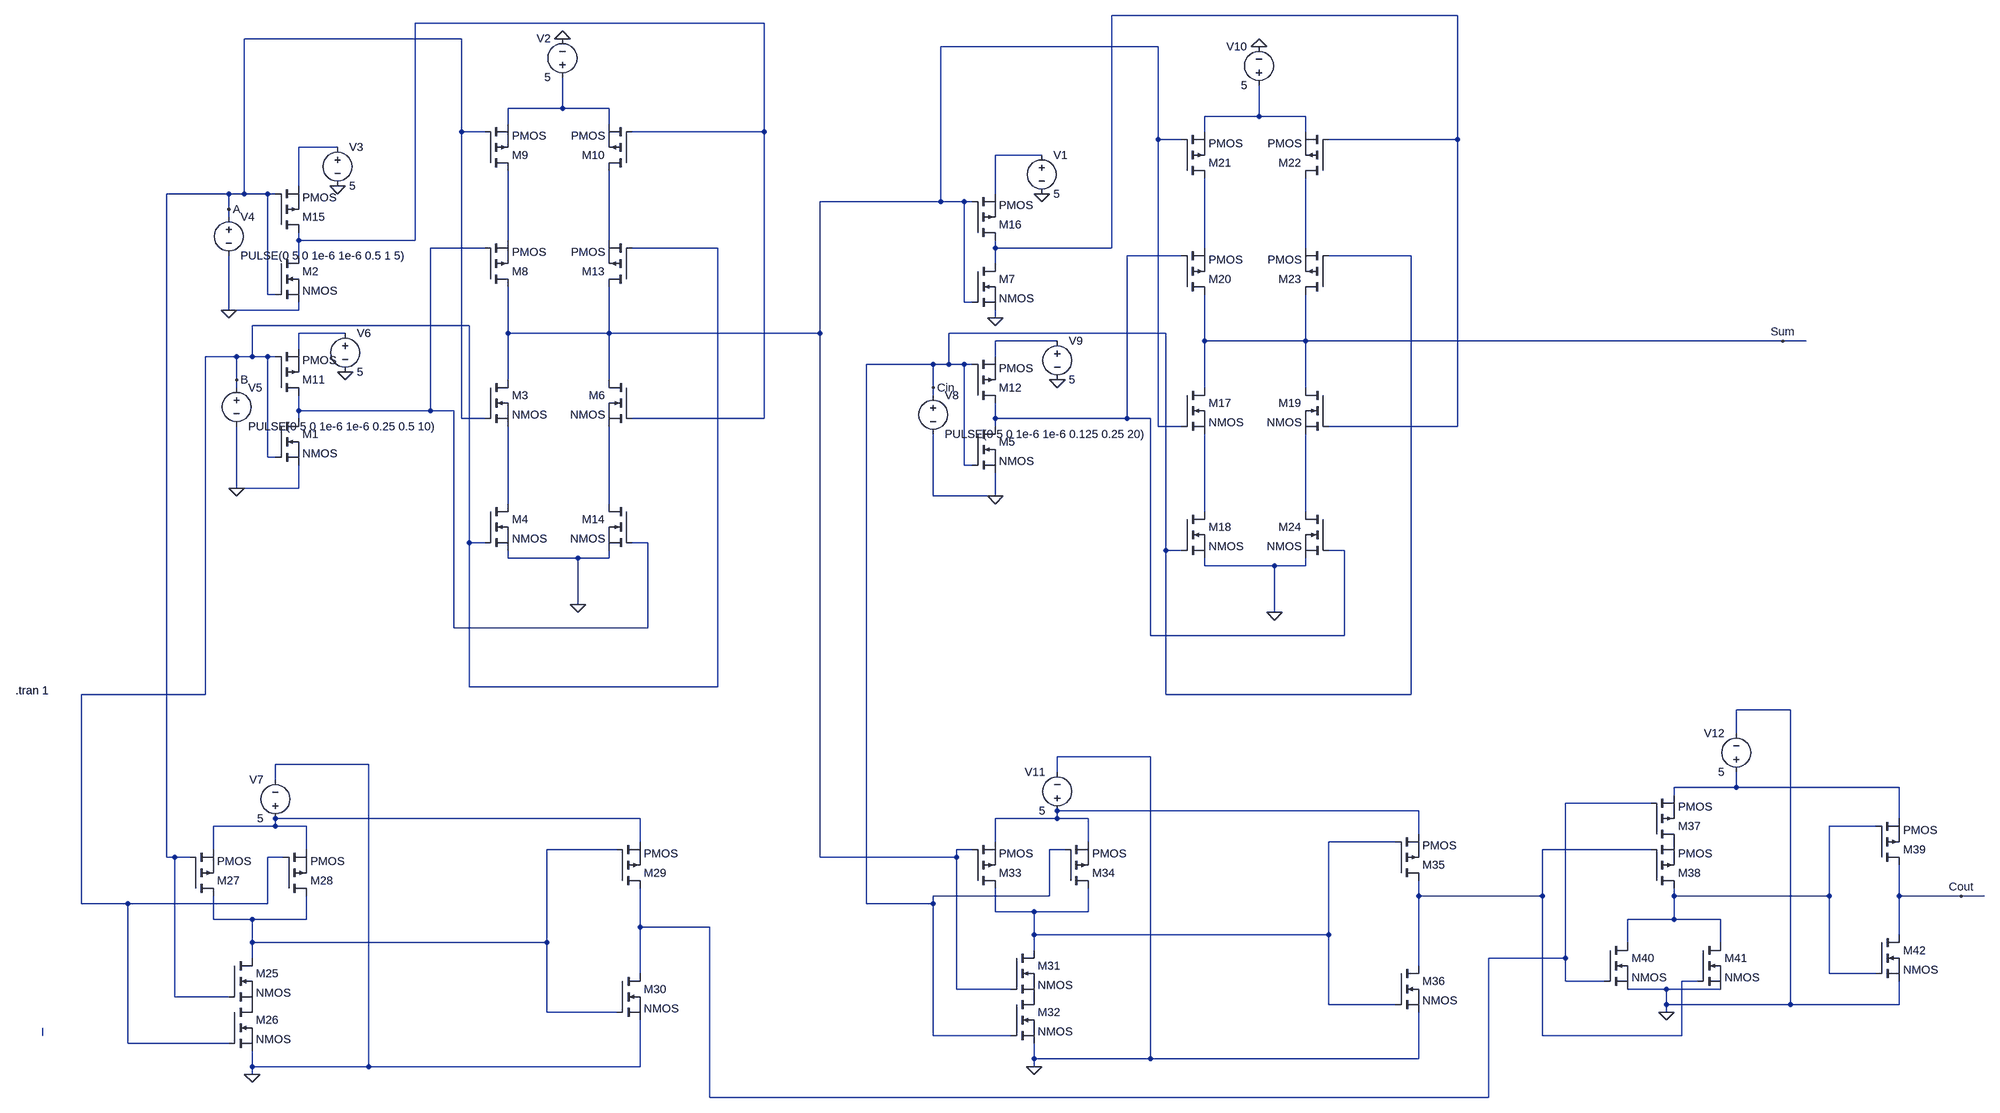
[diagram p0: schematic cmos 1 bit full adder 238.asc]
cmos 1 bit full adder 238.asc, the LTspice schematic file:
Version 4
SHEET 1 6156 4088
WIRE 3136 512 2416 512
WIRE 1216 528 496 528
WIRE 592 560 144 560
WIRE 2512 576 2064 576
WIRE 800 704 800 640
WIRE 800 704 688 704
WIRE 896 704 800 704
WIRE 2720 720 2720 656
WIRE 2720 720 2608 720
WIRE 2816 720 2720 720
WIRE 688 736 688 704
WIRE 896 736 896 704
WIRE 592 752 592 560
WIRE 640 752 592 752
WIRE 1216 752 1216 528
WIRE 1216 752 944 752
WIRE 2608 752 2608 720
WIRE 2816 752 2816 720
WIRE 2512 768 2512 576
WIRE 2560 768 2512 768
WIRE 3136 768 3136 512
WIRE 3136 768 2864 768
WIRE 336 784 256 784
WIRE 2272 800 2176 800
WIRE 256 864 256 784
WIRE 112 880 -16 880
WIRE 144 880 144 560
WIRE 144 880 112 880
WIRE 192 880 144 880
WIRE 208 880 192 880
WIRE 2176 880 2176 800
WIRE 2064 896 2064 576
WIRE 2064 896 1808 896
WIRE 2112 896 2064 896
WIRE 2128 896 2112 896
WIRE 112 912 112 880
WIRE 112 928 112 912
WIRE 256 976 256 960
WIRE 496 976 496 528
WIRE 496 976 256 976
WIRE 688 976 688 832
WIRE 896 976 896 832
WIRE 640 992 528 992
WIRE 1120 992 944 992
WIRE 2176 992 2176 976
WIRE 2416 992 2416 512
WIRE 2416 992 2176 992
WIRE 2608 992 2608 848
WIRE 2816 992 2816 848
WIRE 256 1008 256 976
WIRE 2560 1008 2448 1008
WIRE 3040 1008 2864 1008
WIRE 2176 1024 2176 992
WIRE 192 1088 192 880
WIRE 208 1088 192 1088
WIRE 2112 1104 2112 896
WIRE 2128 1104 2112 1104
WIRE 112 1120 112 1008
WIRE 256 1120 256 1104
WIRE 256 1120 112 1120
WIRE 2176 1136 2176 1120
WIRE 608 1152 160 1152
WIRE 352 1168 256 1168
WIRE 688 1168 688 1072
WIRE 896 1168 896 1072
WIRE 896 1168 688 1168
WIRE 1808 1168 1808 896
WIRE 1808 1168 896 1168
WIRE 2528 1168 2080 1168
WIRE 2304 1184 2176 1184
WIRE 2608 1184 2608 1088
WIRE 2816 1184 2816 1088
WIRE 2816 1184 2608 1184
WIRE 3872 1184 2816 1184
WIRE 3920 1184 3872 1184
WIRE 256 1200 256 1168
WIRE 128 1216 64 1216
WIRE 160 1216 160 1152
WIRE 160 1216 128 1216
WIRE 192 1216 160 1216
WIRE 208 1216 192 1216
WIRE 2176 1216 2176 1184
WIRE 2048 1232 1904 1232
WIRE 2080 1232 2080 1168
WIRE 2080 1232 2048 1232
WIRE 2112 1232 2080 1232
WIRE 2128 1232 2112 1232
WIRE 128 1264 128 1216
WIRE 688 1264 688 1168
WIRE 896 1264 896 1168
WIRE 128 1280 128 1264
WIRE 2048 1280 2048 1232
WIRE 2608 1280 2608 1184
WIRE 2816 1280 2816 1184
WIRE 2048 1296 2048 1280
WIRE 256 1328 256 1296
WIRE 528 1328 528 992
WIRE 528 1328 256 1328
WIRE 576 1328 528 1328
WIRE 256 1344 256 1328
WIRE 592 1344 592 752
WIRE 640 1344 592 1344
WIRE 1216 1344 1216 752
WIRE 1216 1344 944 1344
WIRE 2176 1344 2176 1312
WIRE 2448 1344 2448 1008
WIRE 2448 1344 2176 1344
WIRE 2496 1344 2448 1344
WIRE 2176 1360 2176 1344
WIRE 2512 1360 2512 768
WIRE 2560 1360 2512 1360
WIRE 3136 1360 3136 768
WIRE 3136 1360 2864 1360
WIRE 192 1424 192 1216
WIRE 208 1424 192 1424
WIRE 2112 1440 2112 1232
WIRE 2128 1440 2112 1440
WIRE 128 1488 128 1360
WIRE 256 1488 256 1440
WIRE 256 1488 128 1488
WIRE 2048 1504 2048 1376
WIRE 2176 1504 2176 1456
WIRE 2176 1504 2048 1504
WIRE 688 1520 688 1360
WIRE 896 1520 896 1360
WIRE 2608 1536 2608 1376
WIRE 2816 1536 2816 1376
WIRE 608 1600 608 1152
WIRE 640 1600 608 1600
WIRE 976 1600 944 1600
WIRE 2528 1616 2528 1168
WIRE 2560 1616 2528 1616
WIRE 2896 1616 2864 1616
WIRE 688 1632 688 1616
WIRE 832 1632 688 1632
WIRE 896 1632 896 1616
WIRE 896 1632 832 1632
WIRE 2608 1648 2608 1632
WIRE 2752 1648 2608 1648
WIRE 2816 1648 2816 1632
WIRE 2816 1648 2752 1648
WIRE 832 1728 832 1632
WIRE 2752 1744 2752 1648
WIRE 576 1776 576 1328
WIRE 976 1776 976 1600
WIRE 976 1776 576 1776
WIRE 2496 1792 2496 1344
WIRE 2896 1792 2896 1616
WIRE 2896 1792 2496 1792
WIRE 608 1936 608 1600
WIRE 1120 1936 1120 992
WIRE 1120 1936 608 1936
WIRE 64 1952 64 1216
WIRE 64 1952 -192 1952
WIRE 2528 1952 2528 1616
WIRE 3040 1952 3040 1008
WIRE 3040 1952 2528 1952
WIRE 3888 1984 3776 1984
WIRE 3776 2032 3776 1984
WIRE 2496 2080 2304 2080
WIRE 400 2096 208 2096
WIRE 2304 2112 2304 2080
WIRE 208 2128 208 2096
WIRE 3776 2144 3776 2112
WIRE 3776 2144 3648 2144
WIRE 4112 2144 3776 2144
WIRE 3648 2160 3648 2144
WIRE 3600 2176 3424 2176
WIRE 3056 2192 2304 2192
WIRE 960 2208 208 2208
WIRE 2304 2208 2304 2192
WIRE 2304 2208 2176 2208
WIRE 2368 2208 2304 2208
WIRE 4112 2208 4112 2144
WIRE 208 2224 208 2208
WIRE 208 2224 80 2224
WIRE 272 2224 208 2224
WIRE 4064 2224 3968 2224
WIRE 3056 2240 3056 2192
WIRE 960 2256 960 2208
WIRE 2176 2256 2176 2208
WIRE 2368 2256 2368 2208
WIRE 3008 2256 2864 2256
WIRE 80 2272 80 2224
WIRE 272 2272 272 2224
WIRE 912 2272 768 2272
WIRE 2128 2272 2096 2272
WIRE 2320 2272 2288 2272
WIRE 3600 2272 3376 2272
WIRE -16 2288 -16 880
WIRE 0 2288 -16 2288
WIRE 32 2288 0 2288
WIRE 224 2288 192 2288
WIRE 1808 2288 1808 1168
WIRE 2096 2288 2096 2272
WIRE 2096 2288 1808 2288
WIRE 2288 2368 2288 2272
WIRE 2288 2368 2048 2368
WIRE 3056 2368 3056 2336
WIRE 3376 2368 3376 2272
WIRE 3376 2368 3056 2368
WIRE 3648 2368 3648 2352
WIRE 3968 2368 3968 2224
WIRE 3968 2368 3648 2368
WIRE 4112 2368 4112 2304
WIRE 4240 2368 4112 2368
WIRE 4288 2368 4240 2368
WIRE -192 2384 -192 1952
WIRE -96 2384 -192 2384
WIRE 192 2384 192 2288
WIRE 192 2384 -96 2384
WIRE 1904 2384 1904 1232
WIRE 2048 2384 2048 2368
WIRE 2048 2384 1904 2384
WIRE 2176 2400 2176 2352
WIRE 2256 2400 2176 2400
WIRE 2368 2400 2368 2352
WIRE 2368 2400 2256 2400
WIRE 80 2416 80 2368
WIRE 160 2416 80 2416
WIRE 272 2416 272 2368
WIRE 272 2416 160 2416
WIRE 3648 2416 3648 2368
WIRE 3648 2416 3552 2416
WIRE 3744 2416 3648 2416
WIRE 960 2432 960 2352
WIRE 1104 2432 960 2432
WIRE 2256 2448 2256 2400
WIRE 2864 2448 2864 2256
WIRE 2864 2448 2256 2448
WIRE 4112 2448 4112 2368
WIRE 160 2464 160 2416
WIRE 768 2464 768 2272
WIRE 768 2464 160 2464
WIRE 3552 2464 3552 2416
WIRE 3744 2464 3744 2416
WIRE 2256 2480 2256 2448
WIRE 160 2496 160 2464
WIRE 3424 2496 3424 2176
WIRE 3424 2496 3200 2496
WIRE 3056 2512 3056 2368
WIRE 960 2528 960 2432
WIRE 3968 2528 3968 2368
WIRE 4064 2528 3968 2528
WIRE 3424 2544 3424 2496
WIRE 3504 2544 3424 2544
WIRE 3696 2544 3664 2544
WIRE 2096 2560 2096 2288
WIRE 2208 2560 2096 2560
WIRE 3632 2560 3552 2560
WIRE 3744 2560 3632 2560
WIRE 0 2576 0 2288
WIRE 112 2576 0 2576
WIRE 2864 2592 2864 2448
WIRE 3008 2592 2864 2592
WIRE 3632 2592 3632 2560
WIRE 3888 2592 3888 1984
WIRE 3888 2592 3632 2592
WIRE 4112 2592 4112 2544
WIRE 4112 2592 3888 2592
WIRE 768 2608 768 2464
WIRE 912 2608 768 2608
WIRE 3632 2608 3632 2592
WIRE -272 2656 -272 2640
WIRE 2048 2656 2048 2384
WIRE 2208 2656 2048 2656
WIRE 3376 2656 3376 2368
WIRE 3664 2656 3664 2544
WIRE 3664 2656 3376 2656
WIRE -96 2672 -96 2384
WIRE 112 2672 -96 2672
WIRE 2256 2704 2256 2672
WIRE 2496 2704 2496 2080
WIRE 2496 2704 2256 2704
WIRE 3056 2704 3056 2608
WIRE 3056 2704 2496 2704
WIRE 160 2720 160 2688
WIRE 400 2720 400 2096
WIRE 400 2720 160 2720
WIRE 960 2720 960 2624
WIRE 960 2720 400 2720
WIRE 2256 2720 2256 2704
WIRE 160 2736 160 2720
WIRE 1104 2784 1104 2432
WIRE 3200 2784 3200 2496
WIRE 3200 2784 1104 2784
FLAG 832 1728 0
FLAG 2752 1744 0
FLAG 160 2736 0
FLAG 2256 2720 0
FLAG 3632 2608 0
FLAG 112 912 A
FLAG 128 1264 B
FLAG 2048 1280 Cin
FLAG 3872 1184 Sum
FLAG 4240 2368 Cout
FLAG 112 1120 0
FLAG 336 864 0
FLAG 128 1488 0
FLAG 352 1248 0
FLAG 2176 1136 0
FLAG 2176 1504 0
FLAG 2272 880 0
FLAG 2304 1264 0
FLAG 800 560 0
FLAG 2720 576 0
SYMBOL nmos 208 1344 R0
SYMATTR InstName M1
SYMBOL nmos 208 1008 R0
SYMATTR InstName M2
SYMBOL pmos 208 1296 M180
SYMATTR InstName M11
SYMBOL pmos 208 960 M180
SYMATTR InstName M15
SYMBOL voltage 336 768 R0
WINDOW 123 0 0 Left 2
WINDOW 39 0 0 Left 2
SYMATTR InstName V3
SYMATTR Value 5
SYMBOL voltage 112 912 R0
WINDOW 123 0 0 Left 2
WINDOW 39 0 0 Left 2
SYMATTR InstName V4
SYMATTR Value PULSE(0 5 0 1e-6 1e-6 0.5 1 5)
SYMBOL voltage 128 1264 R0
WINDOW 123 0 0 Left 2
WINDOW 39 0 0 Left 2
SYMATTR InstName V5
SYMATTR Value PULSE(0 5 0 1e-6 1e-6 0.25 0.5 10)
SYMBOL voltage 352 1152 R0
WINDOW 123 0 0 Left 2
WINDOW 39 0 0 Left 2
SYMATTR InstName V6
SYMATTR Value 5
SYMBOL nmos 640 1264 R0
SYMATTR InstName M3
SYMBOL nmos 640 1520 R0
SYMATTR InstName M4
SYMBOL nmos 944 1264 M0
SYMATTR InstName M6
SYMBOL pmos 640 1072 M180
SYMATTR InstName M8
SYMBOL pmos 640 832 M180
SYMATTR InstName M9
SYMBOL pmos 944 832 R180
SYMATTR InstName M10
SYMBOL pmos 944 1072 R180
SYMATTR InstName M13
SYMBOL nmos 944 1520 M0
SYMATTR InstName M14
SYMBOL voltage 800 656 R180
WINDOW 0 24 96 Left 2
WINDOW 3 24 16 Left 2
WINDOW 123 0 0 Left 2
WINDOW 39 0 0 Left 2
SYMATTR InstName V2
SYMATTR Value 5
SYMBOL nmos 2128 1360 R0
SYMATTR InstName M5
SYMBOL nmos 2128 1024 R0
SYMATTR InstName M7
SYMBOL pmos 2128 1312 M180
SYMATTR InstName M12
SYMBOL pmos 2128 976 M180
SYMATTR InstName M16
SYMBOL voltage 2272 784 R0
WINDOW 123 0 0 Left 2
WINDOW 39 0 0 Left 2
SYMATTR InstName V1
SYMATTR Value 5
SYMBOL voltage 2048 1280 R0
WINDOW 123 0 0 Left 2
WINDOW 39 0 0 Left 2
SYMATTR InstName V8
SYMATTR Value PULSE(0 5 0 1e-6 1e-6 0.125 0.25 20)
SYMBOL voltage 2304 1168 R0
WINDOW 123 0 0 Left 2
WINDOW 39 0 0 Left 2
SYMATTR InstName V9
SYMATTR Value 5
SYMBOL nmos 2560 1280 R0
SYMATTR InstName M17
SYMBOL nmos 2560 1536 R0
SYMATTR InstName M18
SYMBOL nmos 2864 1280 M0
SYMATTR InstName M19
SYMBOL pmos 2560 1088 M180
SYMATTR InstName M20
SYMBOL pmos 2560 848 M180
SYMATTR InstName M21
SYMBOL pmos 2864 848 R180
SYMATTR InstName M22
SYMBOL pmos 2864 1088 R180
SYMATTR InstName M23
SYMBOL nmos 2864 1536 M0
SYMATTR InstName M24
SYMBOL voltage 2720 672 R180
WINDOW 0 24 96 Left 2
WINDOW 3 24 16 Left 2
WINDOW 123 0 0 Left 2
WINDOW 39 0 0 Left 2
SYMATTR InstName V10
SYMATTR Value 5
SYMBOL voltage 208 2224 R180
WINDOW 0 24 96 Left 2
WINDOW 3 24 16 Left 2
WINDOW 123 0 0 Left 2
WINDOW 39 0 0 Left 2
SYMATTR InstName V7
SYMATTR Value 5
SYMBOL nmos 112 2496 R0
SYMATTR InstName M25
SYMBOL nmos 112 2592 R0
SYMATTR InstName M26
SYMBOL pmos 32 2368 M180
SYMATTR InstName M27
SYMBOL pmos 224 2368 M180
SYMATTR InstName M28
SYMBOL pmos 912 2352 M180
SYMATTR InstName M29
SYMBOL nmos 912 2528 R0
SYMATTR InstName M30
SYMBOL voltage 2304 2208 R180
WINDOW 0 24 96 Left 2
WINDOW 3 24 16 Left 2
WINDOW 123 0 0 Left 2
WINDOW 39 0 0 Left 2
SYMATTR InstName V11
SYMATTR Value 5
SYMBOL nmos 2208 2480 R0
SYMATTR InstName M31
SYMBOL nmos 2208 2576 R0
SYMATTR InstName M32
SYMBOL pmos 2128 2352 M180
SYMATTR InstName M33
SYMBOL pmos 2320 2352 M180
SYMATTR InstName M34
SYMBOL pmos 3008 2336 M180
SYMATTR InstName M35
SYMBOL nmos 3008 2512 R0
SYMATTR InstName M36
SYMBOL pmos 3600 2256 M180
SYMATTR InstName M37
SYMBOL pmos 3600 2352 M180
SYMATTR InstName M38
SYMBOL pmos 4064 2304 M180
SYMATTR InstName M39
SYMBOL nmos 3504 2464 R0
SYMATTR InstName M40
SYMBOL nmos 3696 2464 R0
SYMATTR InstName M41
SYMBOL nmos 4064 2448 R0
SYMATTR InstName M42
SYMBOL voltage 3776 2128 R180
WINDOW 0 24 96 Left 2
WINDOW 3 24 16 Left 2
WINDOW 123 0 0 Left 2
WINDOW 39 0 0 Left 2
SYMATTR InstName V12
SYMATTR Value 5
TEXT -328 1944 Left 2 !.tran 1

The netlist it stands for:
* cmos 1 bit full adder 238.asc
M1 N010 B 0 0 NMOS
M2 N002 A 0 0 NMOS
M11 N010 B N014 N014 PMOS
M15 N002 A N006 N006 PMOS
V3 N006 0 5
V4 A 0 PULSE(0 5 0 1e-6 1e-6 0.5 1 5)
V5 B 0 PULSE(0 5 0 1e-6 1e-6 0.25 0.5 10)
V6 N014 0 5
M3 N003 A N016 N016 NMOS
M4 N016 B 0 0 NMOS
M6 N003 N002 N017 N017 NMOS
M8 N003 N010 N008 N008 PMOS
M9 N008 A N004 N004 PMOS
M10 N009 N002 N004 N004 PMOS
M13 N003 B N009 N009 PMOS
M14 N017 N010 0 0 NMOS
V2 N004 0 5
M5 N013 Cin 0 0 NMOS
M7 N001 N003 0 0 NMOS
M12 N013 Cin N015 N015 PMOS
M16 N001 N003 N007 N007 PMOS
V1 N007 0 5
V8 Cin 0 PULSE(0 5 0 1e-6 1e-6 0.125 0.25 20)
V9 N015 0 5
M17 Sum N003 N018 N018 NMOS
M18 N018 Cin 0 0 NMOS
M19 Sum N001 N019 N019 NMOS
M20 Sum N013 N011 N011 PMOS
M21 N011 N003 N005 N005 PMOS
M22 N012 N001 N005 N005 PMOS
M23 Sum Cin N012 N012 PMOS
M24 N019 N013 0 0 NMOS
V10 N005 0 5
V7 N023 0 5
M25 N026 A P001 P001 NMOS
M26 P001 B 0 0 NMOS
M27 N026 A N023 N023 PMOS
M28 N026 B N023 N023 PMOS
M29 N021 N026 N023 N023 PMOS
M30 N021 N026 0 0 NMOS
V11 N022 0 5
M31 N025 N003 P002 P002 NMOS
M32 P002 Cin 0 0 NMOS
M33 N025 N003 N022 N022 PMOS
M34 N025 Cin N022 N022 PMOS
M35 N027 N025 N022 N022 PMOS
M36 N027 N025 0 0 NMOS
M37 P003 N021 N020 N020 PMOS
M38 N024 N027 P003 P003 PMOS
M39 Cout N024 N020 N020 PMOS
M40 N024 N021 0 0 NMOS
M41 N024 N027 0 0 NMOS
M42 Cout N024 0 0 NMOS
V12 N020 0 5
.model NMOS NMOS
.model PMOS PMOS
.lib standard.mos
.tran 1
.backanno
.end